# Altium schematic sheet CF_POWER_TREE.SchDoc
size Tabloid; DocumentNumber: 2; SheetNumber: 2; SheetTotal: 10; Size: 11x17; Sheet_Name: Power tree
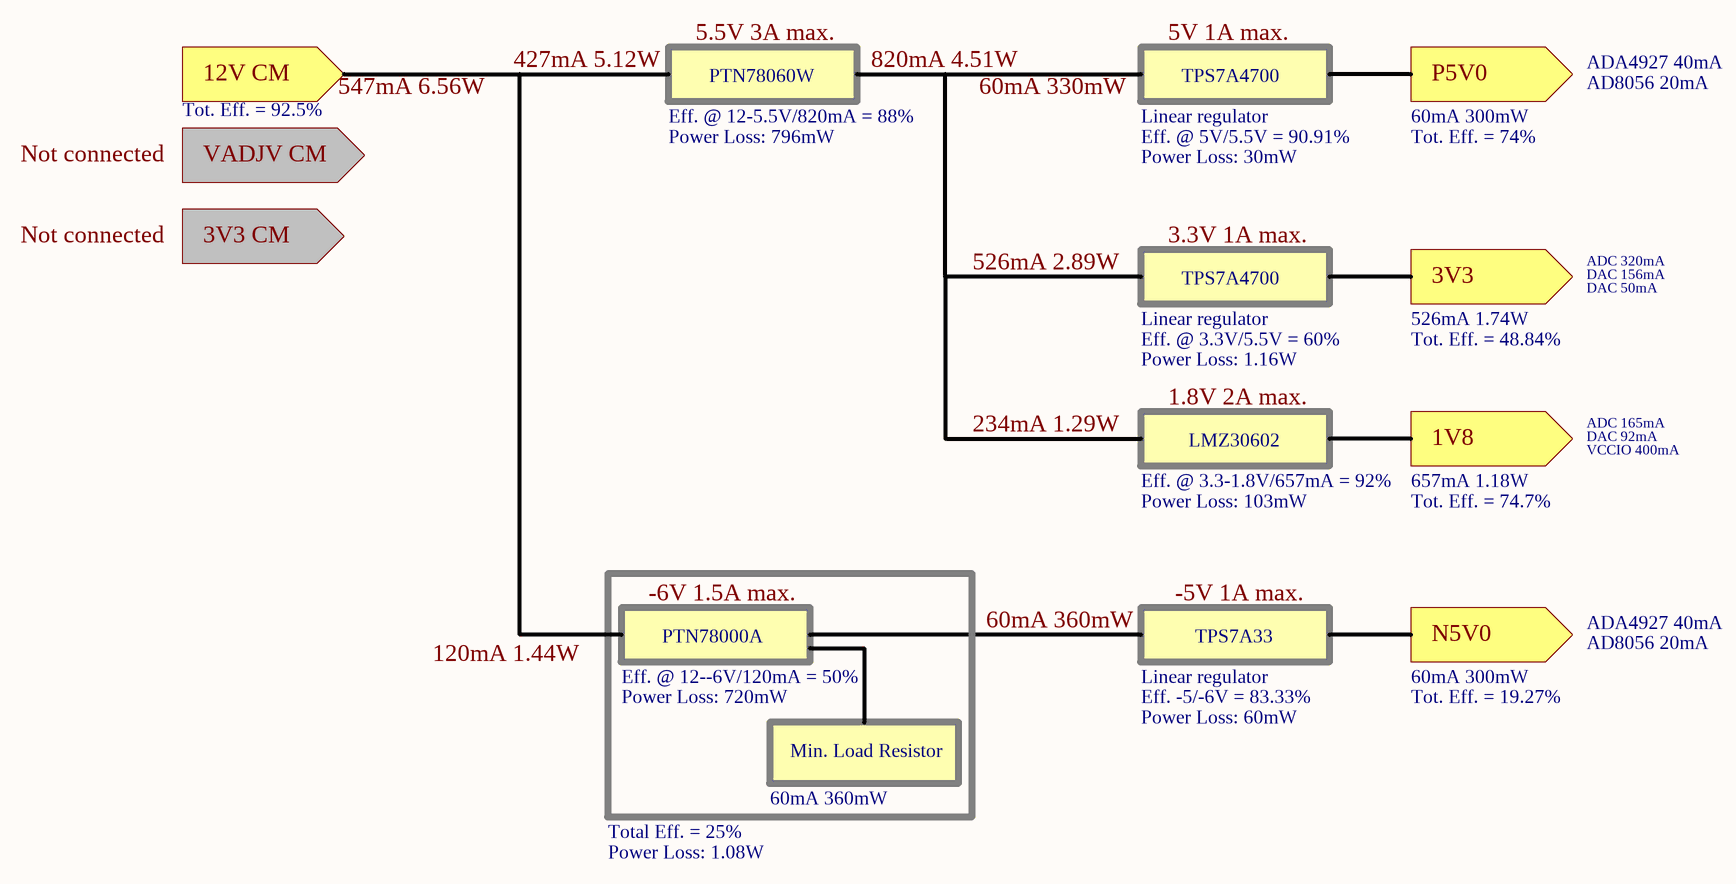
[diagram p0: CF_POWER_TREE.SchDoc]

## Notes on the sheet
- 5.5V 3A max.
- 5V 1A max.
- 12V CM
- 547mA 6.56W
- 427mA 5.12W
- PTN78060W
- 820mA 4.51W
- 60mA 330mW
- TPS7A4700
- P5V0
- ADA4927 40mA
- AD8056 20mA
- Not connected
- Tot. Eff. = 92.5%
- VADJV CM
- Power Loss: 796mW
- Eff. @ 12-5.5V/820mA = 88%
- Power Loss: 30mW
- Eff. @ 5V/5.5V = 90.91%
- Linear regulator
- 60mA 300mW
- Tot. Eff. = 74%
- 3V3 CM
- 526mA 2.89W
- 3.3V 1A max.
- 3V3
- ADC 320mA
- DAC 156mA
- DAC 50mA
- Power Loss: 1.16W
- Eff. @ 3.3V/5.5V = 60%
- 526mA 1.74W
- Tot. Eff. = 48.84%
- 234mA 1.29W
- 1.8V 2A max.
- LMZ30602
- 1V8
- ADC 165mA
- DAC 92mA
- Power Loss: 103mW
- Eff. @ 3.3-1.8V/657mA = 92%
- 657mA 1.18W
- Tot. Eff. = 74.7%
- VCCIO 400mA
- -6V 1.5A max.
- PTN78000A
- 60mA 360mW
- -5V 1A max.
- TPS7A33
- N5V0
- 120mA 1.44W
- Power Loss: 720mW
- Eff. @ 12--6V/120mA = 50%
- Eff. -5/-6V = 83.33%
- Tot. Eff. = 19.27%
- Min. Load Resistor
- Power Loss: 60mW
- Total Eff. = 25%
- Power Loss: 1.08W
- Sheet Name
- Project Title
- Global Project
- Size
- Group
- Revision
- Date
- Sheet
- of
- Filename
- Designers